# Altium schematic sheet sch.SchDoc
size A3
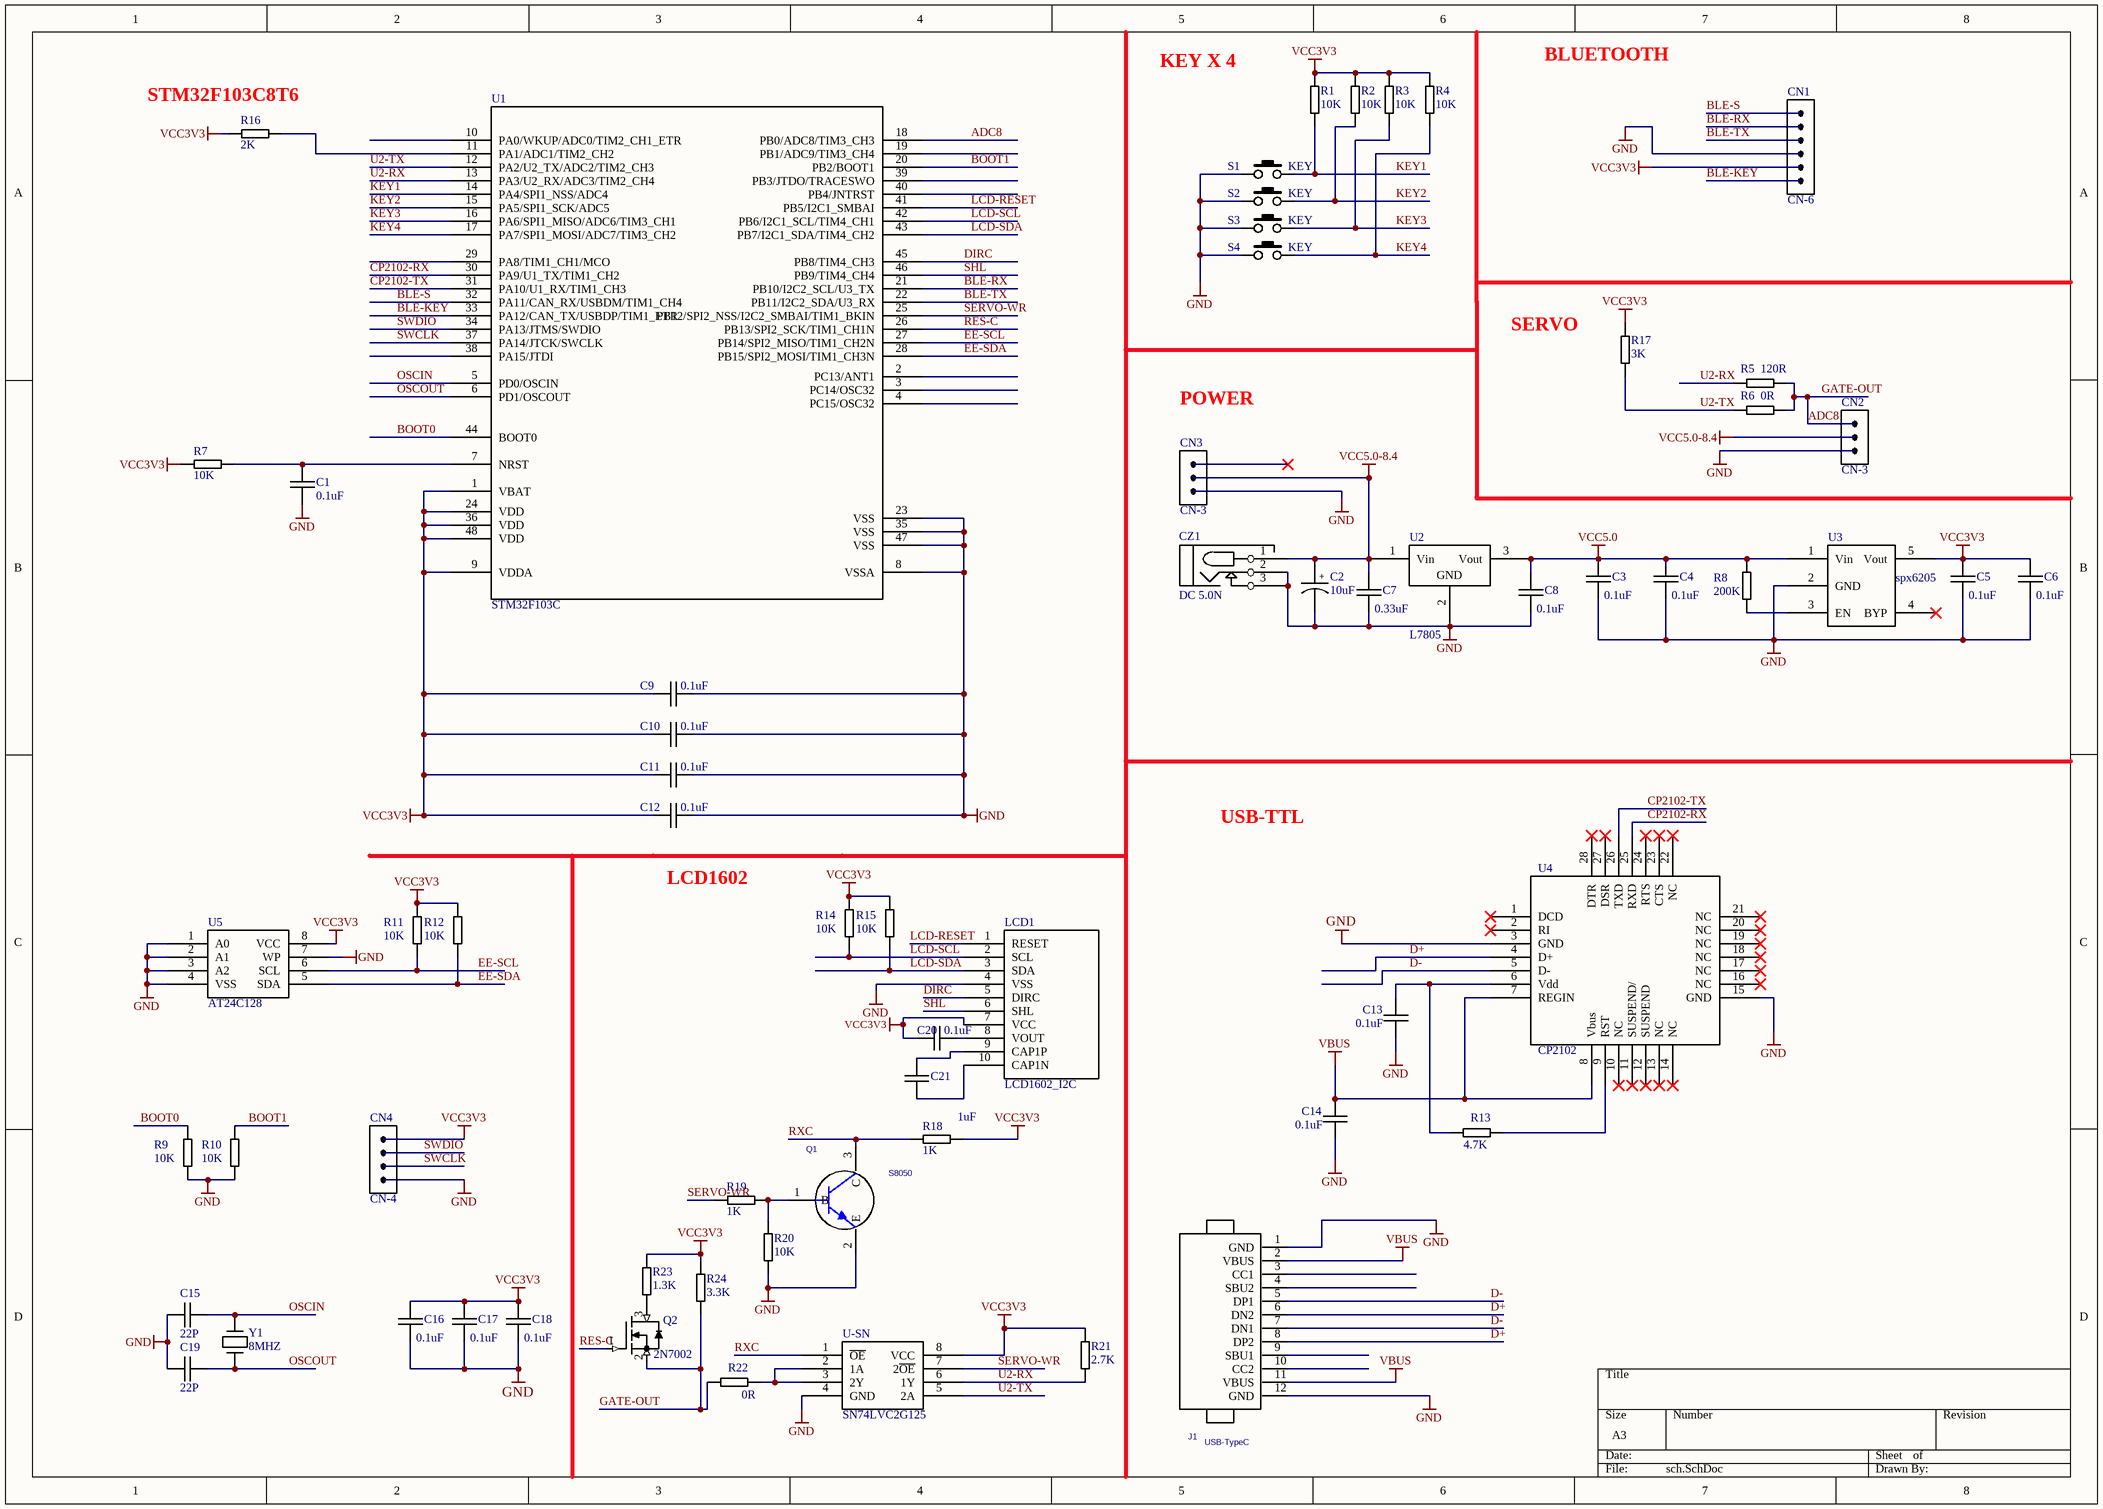
[diagram p0: sch.SchDoc]

## Parts
C1  0.1uF  [CAP-0603]
C2  10uF  [CAP-A]
C3  0.1uF  [CAP-0603]
C4  0.1uF  [CAP-0603]
C5  0.1uF  [CAP-0603]
C6  0.1uF  [CAP-0603]
C7  0.33uF  [CAP-0603]
C8  0.1uF  [CAP-0603]
C9  0.1uF  [CAP-0603]
C10  0.1uF  [CAP-0603]
C11  0.1uF  [CAP-0603]
C12  0.1uF  [CAP-0603]
C13  0.1uF  [CAP-0603]
C14  0.1uF  [CAP-0603]
C15  22P  [CAP-0603]
C16  0.1uF  [CAP-0603]
C17  0.1uF  [CAP-0603]
C18  0.1uF  [CAP-0603]
C19  22P  [CAP-0603]
C20  0.1uF  [CAP-0603]
C21  1uF  [CAP-0603]
CN1  CN-6  [CN-6]
CN2  CN-3  [IDC-3×1]
CN3  CN-3  [IDC-3×1]
CN4  CN-4  [IDC-4×1]
CZ1  DC 5.0N  [DC-005(N)]
J1  USB-TypeC  [USB-TYPEC]
LCD1  LCD1602_I2C  [LCD-IIC]
Q1  S8050  [SOT-23(3)]
Q2  2N7002  [SOT-23(3)]
R1  10K  [RES-0603]
R2  10K  [RES-0603]
R3  10K  [RES-0603]
R4  10K  [RES-0603]
R5  120R  [RES-0603]
R6  0R  [RES-0603]
R7  10K  [RES-0603]
R8  200K  [RES-0603]
R9  10K  [RES-0603]
R10  10K  [RES-0603]
R11  10K  [RES-0603]
R12  10K  [RES-0603]
R13  4.7K  [RES-0603]
R14  10K  [RES-0603]
R15  10K  [RES-0603]
R16  2K  [RES-0603]
R17  3K  [RES-0603]
R18  1K  [RES-0603]
R19  1K  [RES-0603]
R20  10K  [RES-0603]
R21  2.7K  [RES-0603]
R22  0R  [RES-0603]
R23  1.3K  [RES-0603]
R24  3.3K  [RES-0603]
S1  KEY  [KEY-4X4X1.5]
S2  KEY  [KEY-4X4X1.5]
S3  KEY  [KEY-4X4X1.5]
S4  KEY  [KEY-4X4X1.5]
U1  STM32F103C  [LQFP-48]
U2  L7805  [TO-252]
U3  spx6205  [SOT-23(5)]
U4  CP2102  [QFN-28]
U5  AT24C128  [SOP-8(3.9)]
U-SN  SN74LVC2G125  [SOP-8(SN74)]
Y1  8MHZ  [XTAL-2512]

## Nets
GND: C1.2 C2.2 C3.2 C4.2 C5.2 C6.2 C7.2 C8.2 C9.1 C10.1 C11.1 C12.1 C13.2 C14.2 C15.1 C16.2 C17.2 C18.2 C19.1 CN1.4 CN2.3 CN3.3 CN4.4 CZ1.2(A) CZ1.3(B) J1.1(GND) J1.12(GND) LCD1.4(VSS) Q1.2(E) R9.2 R10.2 R20.2 S1.1 S2.1 S3.1 S4.1 U1.8(VSSA) U1.23(VSS) U1.35(VSS) U1.47(VSS) U2.2(GND) U3.2(GND) U4.3(GND) U4.15(GND) U5.1(A0) U5.2(A1) U5.3(A2) U5.4(VSS) U5.7(WP) U-SN.4(GND)
VBUS: C14.1 J1.2(VBUS) J1.11(VBUS) U4.7(REGIN) U4.8(Vbus)
VCC3V3: C5.1 C6.1 C9.2 C10.2 C11.2 C12.2 C16.1 C17.1 C18.1 C20.1 CN1.5 CN4.1 LCD1.7(VCC) R1.2 R2.2 R3.2 R4.2 R7.1 R11.1 R12.1 R14.1 R15.1 R16.2 R17.2 R18.2 R21.2 R23.2 R24.2 U1.1(VBAT) U1.9(VDDA) U1.24(VDD) U1.36(VDD) U1.48(VDD) U3.5(Vout) U5.8(VCC) U-SN.8(VCC)
VCC5.0: C3.1 C4.1 C8.1 R8.1 U2.3(Vout) U3.1(Vin)
VCC5.0-8.4: C2.1 C7.1 CN2.2 CN3.2 CZ1.1(+) U2.1(Vin)
ADC8: CN2.1 Q2.2(S) R5.2 R6.2 R22.2 R24.1 U1.18(PB0/ADC8/TIM3_CH3)  [also labelled GATE-OUT]
BLE-KEY: CN1.6 U1.33(PA12/CAN_TX/USBDP/TIM1_ETR)
BLE-RX: CN1.2 U1.21(PB10/I2C2_SCL/U3_TX)
BLE-S: CN1.1 U1.32(PA11/CAN_RX/USBDM/TIM1_CH4)
BLE-TX: CN1.3 U1.22(PB11/I2C2_SDA/U3_RX)
BOOT0: R9.1 U1.44(BOOT0)
BOOT1: R10.1 U1.20(PB2/BOOT1)
CP2102-RX: U1.30(PA9/U1_TX/TIM1_CH2) U4.25(RXD)
CP2102-TX: U1.31(PA10/U1_RX/TIM1_CH3) U4.26(TXD)
D+: J1.6(DN2) J1.8(DP2) U4.4(D+)
D-: J1.5(DP1) J1.7(DN1) U4.5(D-)
DIRC: LCD1.5(DIRC) U1.45(PB8/TIM4_CH3)
EE-SCL: R11.2 U1.27(PB14/SPI2_MISO/TIM1_CH2N) U5.6(SCL)
EE-SDA: R12.2 U1.28(PB15/SPI2_MOSI/TIM1_CH3N) U5.5(SDA)
KEY1: R1.1 S1.2 U1.14(PA4/SPI1_NSS/ADC4)
KEY2: R2.1 S2.2 U1.15(PA5/SPI1_SCK/ADC5)
KEY3: R3.1 S3.2 U1.16(PA6/SPI1_MISO/ADC6/TIM3_CH1)
KEY4: R4.1 S4.2 U1.17(PA7/SPI1_MOSI/ADC7/TIM3_CH2)
LCD-RESET: LCD1.1(RESET) U1.41(PB5/I2C1_SMBAI)
LCD-SCL: LCD1.2(SCL) R14.2 U1.42(PB6/I2C1_SCL/TIM4_CH1)
LCD-SDA: LCD1.3(SDA) R15.2 U1.43(PB7/I2C1_SDA/TIM4_CH2)
OSCIN: C15.2 U1.5(PD0/OSCIN) Y1.2
OSCOUT: C19.2 U1.6(PD1/OSCOUT) Y1.1
RES-C: Q2.1(G) U1.26(PB13/SPI2_SCK/TIM1_CH1N)
RXC: Q1.3(C) R18.1 U-SN.1(~{OE})
SERVO-WR: R19.1 U1.25(PB12/SPI2_NSS/I2C2_SMBAI/TIM1_BKIN) U-SN.7(2~{OE})
SHL: LCD1.6(SHL) U1.46(PB9/TIM4_CH4)
SWCLK: CN4.3 U1.37(PA14/JTCK/SWCLK)
SWDIO: CN4.2 U1.34(PA13/JTMS/SWDIO)
U2-RX: R5.1 R21.1 U1.13(PA3/U2_RX/ADC3/TIM2_CH4) U-SN.6(1Y)
U2-TX: R6.1 R17.1 U1.12(PA2/U2_TX/ADC2/TIM2_CH3) U-SN.5(2A)
NetC1_1: C1.1 R7.2 U1.7(NRST)
NetC13_1: C13.1 R13.1 U4.6(Vdd)
NetC20_2: C20.2 LCD1.8(VOUT)
NetC21_1: C21.1 LCD1.9(CAP1P)
NetC21_2: C21.2 LCD1.10(CAP1N)
NetQ1_1: Q1.1(B) R19.2 R20.1
NetQ2_3: Q2.3(D) R23.1
NetR8_2: R8.2 U3.3(EN)
NetR13_2: R13.2 U4.9(RST)
NetR16_1: R16.1 U1.11(PA1/ADC1/TIM2_CH2)
NetR22_1: R22.1 U-SN.2(1A) U-SN.3(2Y)

Not connected (* = marked no-connect by the designer): CN3 1*; J1 3(CC1) 4(SBU2) 9(SBU1) 10(CC2); U1 2(PC13/ANT1) 3(PC14/OSC32) 4(PC15/OSC32) 10(PA0/WKUP/ADC0/TIM2_CH1_ETR) 19(PB1/ADC9/TIM3_CH4) 29(PA8/TIM1_CH1/MCO) 38(PA15/JTDI) 39(PB3/JTDO/TRACESWO) 40(PB4/JNTRST); U3 4(BYP)*; U4 1(DCD)* 2(RI)* 10(NC)* 11(SUSPEND/)* 12(SUSPEND)* 13(NC)* 14(NC)* 16(NC)* 17(NC)* 18(NC)* 19(NC)* 20(NC)* 21(NC)* 22(NC)* 23(CTS)* 24(RTS)* 27(DSR)* 28(DTR)*

## Notes on the sheet
- (near R16) STM32F103C8T6
- KEY X 4
- BLUETOOTH
- SERVO
- POWER
- USB-TTL
- (near C12) LCD1602
- (in symbol CAP(POL)) +

## Library data of the parts
C1 C3-C21 = CAP: Capacitor
C2 = CAP(POL): Polar Capacitor
J1 = USB-TypeC: PCB DECAL: USB-MINI
LCD1 = LCD1602_I2C: LCD1602
Q1 = S8050: NPN; PCB DECAL: SOT-23; Manufacturer #2: 8050
Q2 = FET(N)_SOT
R1-R24 = RES: Resistor
U1 = STM32F103C(LQFP): Published: 30-May-2008; DatasheetVersion: rev6, Mar-2008; PackageVersion: Mar-2008; PackageReference: LQFP48; Publisher: Altium Limited; PackageDescription: 48-Pin Low-Profile Quad Flat Pack, 7 x 7 mm Body, 0.5 mm Pitch (LQFP48); ComponentLink1Description: Manufacturer Link; ComponentLink1URL: www.st.com/stm32; ComponentLink2Description: Datasheet; ComponentLink2URL: http://www.st.com/stonline/products/literature/ds/13587.pdf
U2 = 78XX
U3 = SP6205(FIXED)
U4 = MPU6050_1
Y1 = XTAL(1): Crystal